# EAGLE design Renard48-6 V4 (EAGLE 5.09)
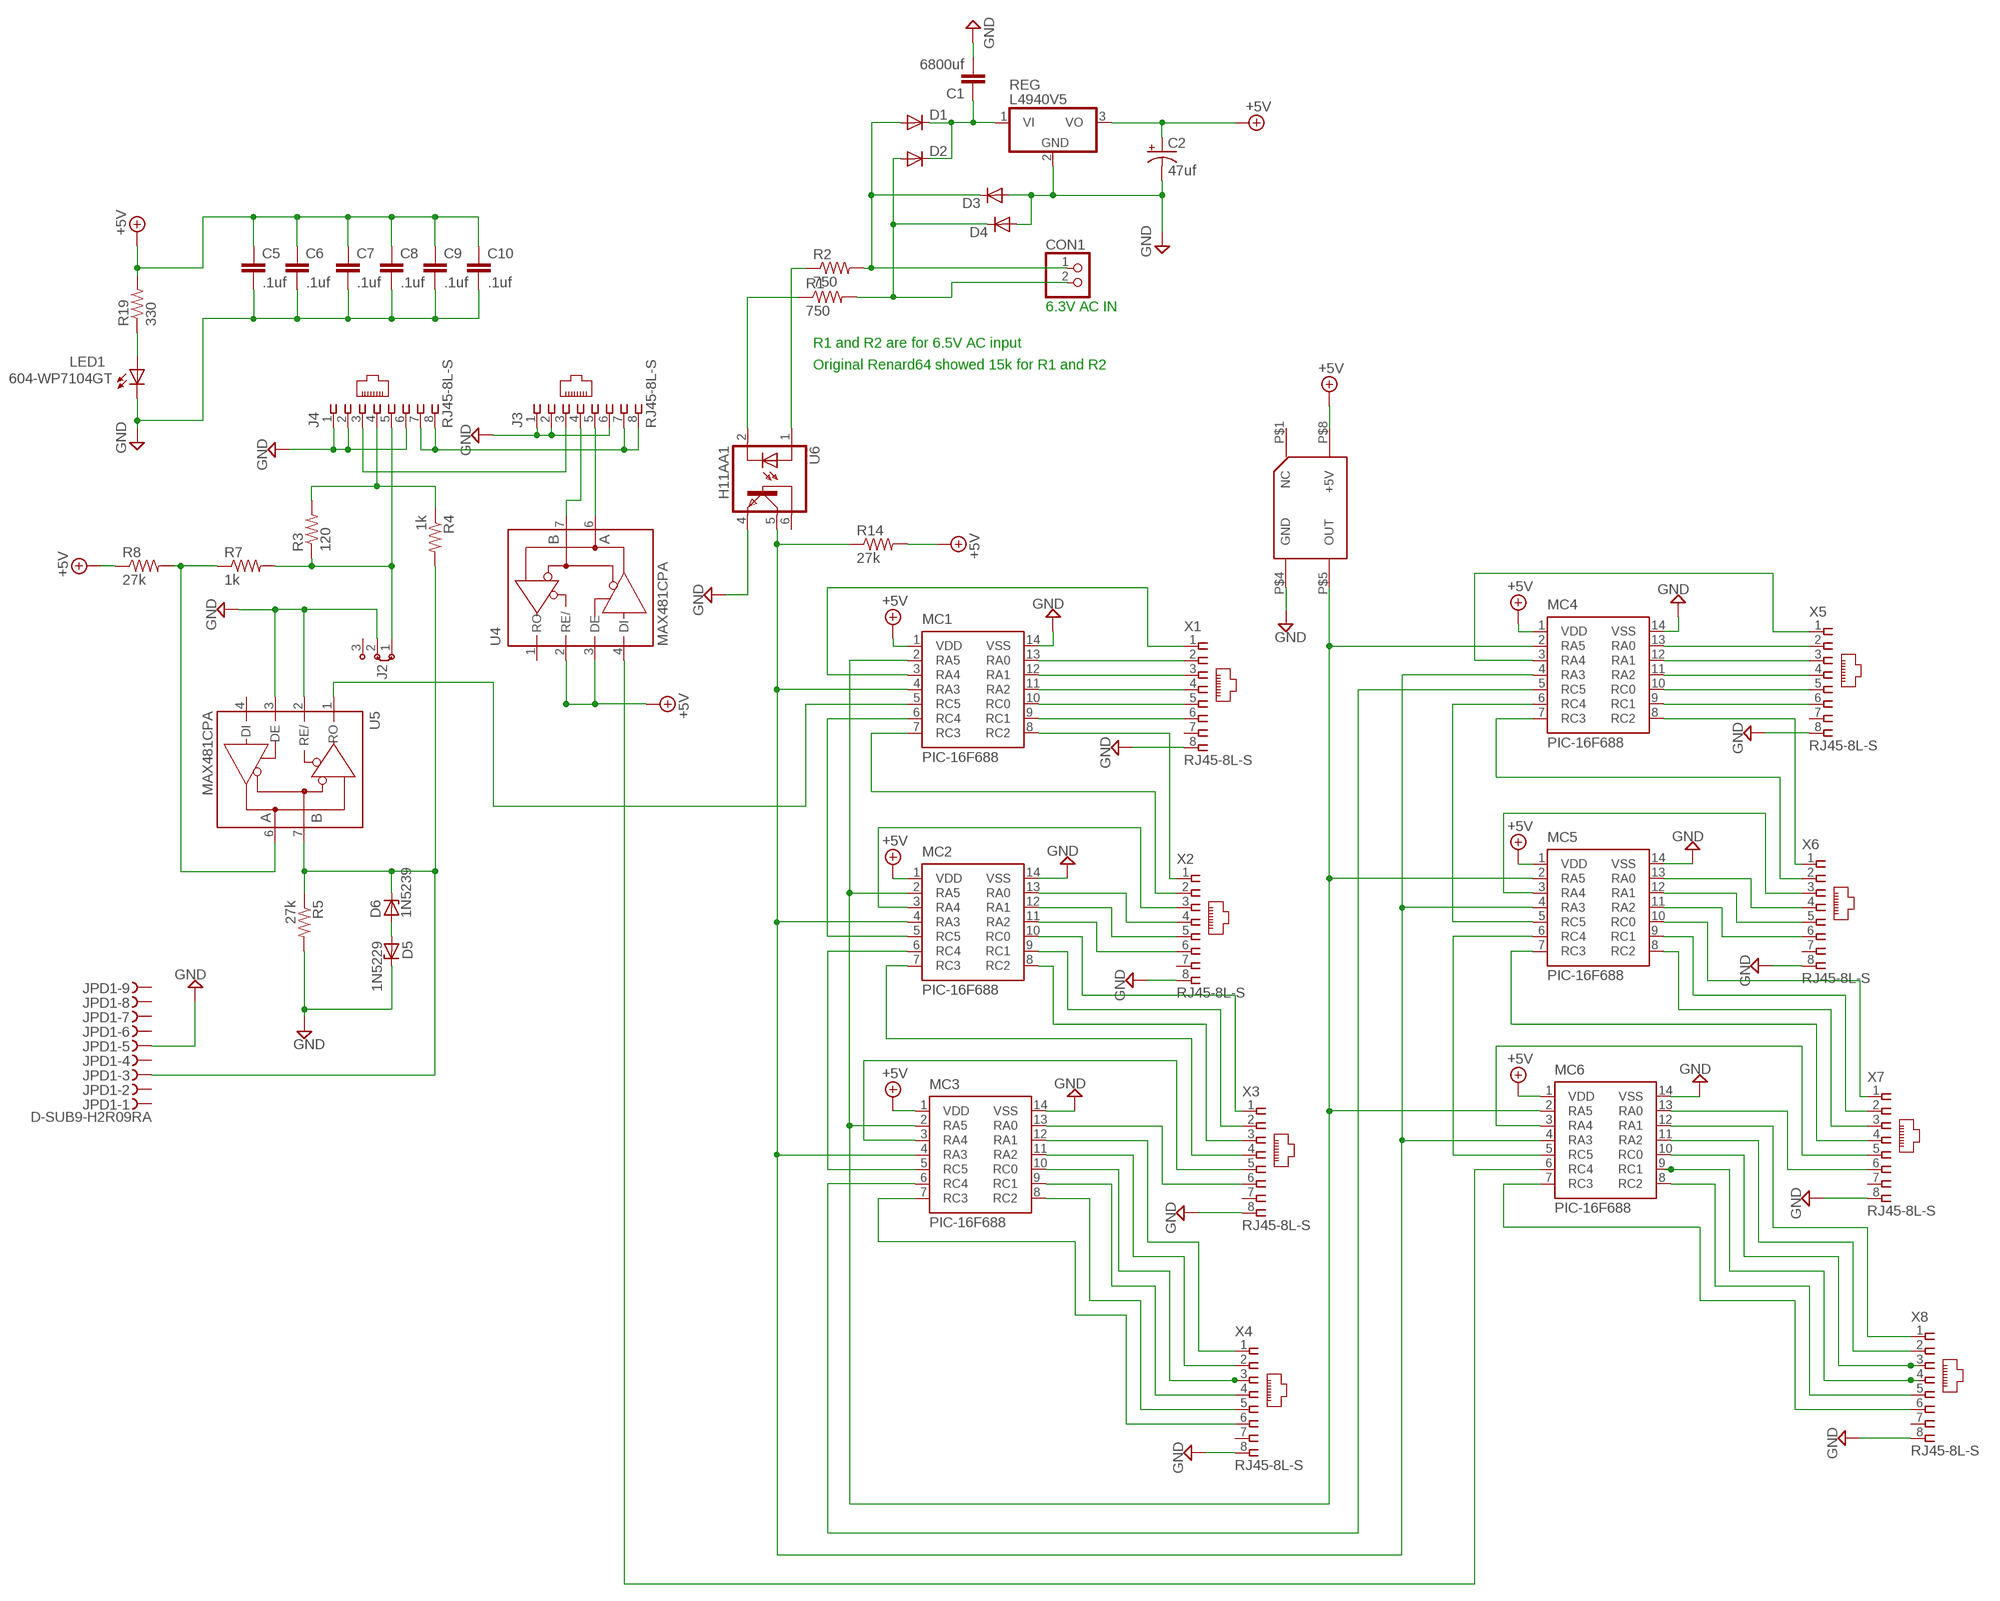
[diagram p0: schematic, sheet 1]

## Parts
C1  6800uf  C7.5/6  [C7.5B6]
C2  47uf  CPOL-USE3.5-8  [E3,5-8]
C5  .1uf  C5/5  [C5B5]
C6  .1uf  C5/5  [C5B5]
C7  .1uf  C5/5  [C5B5]
C8  .1uf  C5/5  [C5B5]
C9  .1uf  C5/5  [C5B5]
C10  .1uf  C5/5  [C5B5]
CON1  PINHD-1X2  [1X02]
D1  DIODE-DO41-10  [DO41-10]
D2  DIODE-DO41-10  [DO41-10]
D3  DIODE-DO41-10  [DO41-10]
D4  DIODE-DO41-10  [DO41-10]
D5  1N5229  ZENER-DIODEDO35Z10  [DO35Z10]
D6  1N5239  ZENER-DIODEDO35Z10  [DO35Z10]
J2  J2X2MM  [04C]
J3  RJ45-8L-S  [RJ45-NO-SHIELD]
J4  RJ45-8L-S  [RJ45-NO-SHIELD]
JPD1  D-SUB9-H2R09RA  [H2R09RA]
LED1  604-WP7104GT  LED3MM  [LED3MM]
MC1  PIC-16F688  [DIL14]
MC2  PIC-16F688  [DIL14]
MC3  PIC-16F688  [DIL14]
MC4  PIC-16F688  [DIL14]
MC5  PIC-16F688  [DIL14]
MC6  PIC-16F688  [DIL14]
OSC  520-TCH1843-X  [4-PIN]
R1  750  R-US_0309/10  [0309/10]
R2  750  R-US_0309/10  [0309/10]
R3  120  R-US_0309/10  [0309/10]
R4  1k  R-US_0309/10  [0309/10]
R5  27k  R-US_0309/10  [0309/10]
R7  1k  R-US_0309/10  [0309/10]
R8  27k  R-US_0309/10  [0309/10]
R14  27k  R-US_0309/10  [0309/10]
R19  330  R-US_0309/10  [0309/10]
REG  L4940V5  7805T  [TO220H]
U4  MAX481CPA  [DIL08]
U5  MAX481CPA  [DIL08]
U6  H11AA1  H11A1M  [DIL06]
X1  RJ45-8L-S  [RJ45-NO-SHIELD]
X2  RJ45-8L-S  [RJ45-NO-SHIELD]
X3  RJ45-8L-S  [RJ45-NO-SHIELD]
X4  RJ45-8L-S  [RJ45-NO-SHIELD]
X5  RJ45-8L-S  [RJ45-NO-SHIELD]
X6  RJ45-8L-S  [RJ45-NO-SHIELD]
X7  RJ45-8L-S  [RJ45-NO-SHIELD]
X8  RJ45-8L-S  [RJ45-NO-SHIELD]

## Nets
+5V: C2.+ C5.1 C6.1 C7.1 C8.1 C9.1 C10.1 MC1.1(VDD) MC2.1(VDD) MC3.1(VDD) MC4.1(VDD) MC5.1(VDD) MC6.1(VDD) OSC.P$8(+5V) R8.1 R14.2 R19.2 REG.3(VO) U4.2(RE/) U4.3(DE)
GND: C1.2 C2.- C5.2 C6.2 C7.2 C8.2 C9.2 C10.2 D3.A D4.A D5.C J2.2 J3.1 J3.2 J3.6 J4.1 J4.2 J4.6 JPD1.5 LED1.K(C) MC1.14(VSS) MC2.14(VSS) MC3.14(VSS) MC4.14(VSS) MC5.14(VSS) MC6.14(VSS) OSC.P$4(GND) R5.2 REG.2(GND) U5.2(RE/) U5.3(DE) U6.4(EMI) X1.8 X2.8 X3.8 X4.8 X5.8 X6.8 X7.8 X8.8
N$1: MC1.3(RA4) X1.1
N$2: MC1.13(RA0) X1.2
N$3: MC1.12(RA1) X1.3
N$4: MC1.11(RA2) X1.4
N$5: MC1.10(RC0) X1.5
N$6: MC1.9(RC1) X1.6
N$7: J2.1 J4.5 R3.1 R7.2
N$8: J3.7 J3.8 J4.7 J4.8
N$9: MC1.8(RC2) X2.1
N$10: MC2.13(RA0) X2.4
N$11: MC2.3(RA4) X2.3
N$12: MC2.12(RA1) X2.5
N$13: MC2.11(RA2) X2.6
N$14: MC2.10(RC0) X3.1
N$15: MC2.9(RC1) X3.2
N$16: MC1.7(RC3) X2.2
N$17: MC2.8(RC2) X3.3
N$18: MC3.3(RA4) X3.5
N$19: MC6.6(RC4) U4.4(DI)
N$20: CON1.1 D1.A D3.C R2.2
N$21: MC3.13(RA0) X3.6
N$22: MC3.12(RA1) X4.1
N$23: MC3.11(RA2) X4.2
N$24: MC2.7(RC3) X3.4
N$25: MC3.10(RC0) X4.3
N$26: J3.5 U4.6(A)
N$27: MC6.3(RA4) X7.5
N$28: MC3.7(RC3) X4.6
N$29: J3.4 U4.7(B)
N$30: J3.3 J4.3
N$31: R7.1 R8.2 U5.6(A)
N$32: J4.4 R3.2 R4.1
N$33: D6.C JPD1.3 R4.2 R5.1 U5.7(B)
N$34: D5.A D6.A
N$35: CON1.2 D2.A D4.C R1.2
N$36: R2.1 U6.1(A)
N$37: R1.1 U6.2(C)
N$38: MC1.5(RC5) U5.1(RO)
N$39: MC3.8(RC2) X4.5
N$40: MC4.3(RA4) X5.1
N$41: MC5.3(RA4) X6.3
N$42: MC3.9(RC1) X4.4
N$43: MC5.7(RC3) X7.4
N$44: MC6.7(RC3) X8.6
N$45: MC4.7(RC3) X6.2
N$46: LED1.A R19.1
N$47: MC3.6(RC4) MC4.5(RC5)
N$48: MC5.6(RC4) MC6.5(RC5)
N$49: MC4.6(RC4) MC5.5(RC5)
N$50: MC4.13(RA0) X5.2
N$51: MC4.12(RA1) X5.3
N$52: MC4.11(RA2) X5.4
N$53: MC4.10(RC0) X5.5
N$54: MC4.9(RC1) X5.6
N$55: MC4.8(RC2) X6.1
N$56: MC5.13(RA0) X6.4
N$57: MC5.12(RA1) X6.5
N$58: MC5.11(RA2) X6.6
N$59: MC5.10(RC0) X7.1
N$60: MC5.9(RC1) X7.2
N$61: MC5.8(RC2) X7.3
N$62: MC1.2(RA5) MC2.2(RA5) MC3.2(RA5) MC4.2(RA5) MC5.2(RA5) MC6.2(RA5) OSC.P$5(OUT)
N$63: MC6.13(RA0) X7.6
N$64: MC6.12(RA1) X8.1
N$65: MC6.11(RA2) X8.2
N$66: MC6.10(RC0) X8.3
N$67: MC6.9(RC1) X8.4
N$68: MC6.8(RC2) X8.5
N$70: C1.1 D1.C D2.C REG.1(VI)
N$80: MC1.4(RA3) MC2.4(RA3) MC3.4(RA3) MC4.4(RA3) MC5.4(RA3) MC6.4(RA3) R14.1 U6.5(COL)
N$81: MC1.6(RC4) MC2.5(RC5)
N$82: MC2.6(RC4) MC3.5(RC5)
Unconnected: J2.3 JPD1.1 JPD1.2 JPD1.4 JPD1.6 JPD1.7 JPD1.8 JPD1.9 OSC.P$1(NC) U4.1(RO) U5.4(DI) U6.6(BAS) X1.7 X2.7 X3.7 X4.7 X5.7 X6.7 X7.7 X8.7

## Notes on the sheet
- 6.3V AC IN
- R1 and R2 are for 6.5V AC input
- Original Renard64 showed 15k for R1 and R2

## Power pins joined to a net without a drawn wire
GND: U4.5(GND) U5.5(GND)
VCC: U4.8(VCC) U5.8(VCC)

## Library data of the parts
C1 C5-C10 = capacitor-wima:C: CAPACITOR naming: grid - package width
C2 = rcl:CPOL-US: POLARIZED CAPACITOR, American symbol
CON1 = pinhead:PINHD-1X2: PIN HEADER
D1-D4 = diode:DIODE-: DIODE
D5 D6 = diode:ZENER-DIODE: Z-Diode
J2 = jumper:J2: Jumper switch 2 x 2.5 mm
J3 J4 X1-X8 = con-tycoelectronics:RJ45: CORCOM Modular RJ Jacks No Shield Source: www.tycoelectronics.com .. ENG_DS_1654001_1099_RJ_L_0507.pdf
JPD1 = con-thomas-betts:D-SUB9-: D-Subminiatur Connector Source: Electronioc Interconnects European Edition 1998
LED1 = led:LED: LED OSRAM: - CHIPLED LG R971, LG N971, LY N971, LG Q971, LY Q971, LO R971, LY R971 LH N974, LH R974 LS Q976, LO Q976, LY Q976 LO Q996 - Hyper CHIPLED LW Q18S LB Q993, LB Q99A, LB R99A - SideLED LS A670, LO A670, LY A670, LG A670, LP A670 LB A673, LV A673, LT A673, LW A673 LH A674 LY A675 LS A676, LA A676, LO A676, LY A676, LW A676 LS A679, LY A679, LG A679 - Hyper Micro SIDELED® LS Y876, LA Y876, LO Y876, LY Y876 LT Y87S - SmartLED LW L88C, LW L88S LB L89C, LB L89S, LG L890 LS L89K, LO L89K, LY L89K LS L896, LA L896, LO L896, LY L896 - TOPLED LS T670, LO T670, LY T670, LG T670, LP T670 LSG T670, LSP T670, LSY T670, LOP T670, LYG T670 LG T671, LOG T671, LSG T671 LB T673, LV T673, LT T673, LW T673 LH T674 LS T676, LA T676, LO T676, LY T676, LB T676, LH T676, LSB T676, LW T676 LB T67C, LV T67C, LT T67C, LS T67K, LO T67K, LY T67K, LW E67C LS E67B, LA E67B, LO E67B, LY E67B, LB E67C, LV E67C, LT E67C LW T67C LS T679, LY T679, LG T679 LS T770, LO T770, LY T770, LG T770, LP T770 LB T773, LV T773, LT T773, LW T773 LH T774 LS E675, LA E675, LY E675, LS T675 LS T776, LA T776, LO T776, LY T776, LB T776 LHGB T686 LT T68C, LB T68C - Hyper Mini TOPLED® LB M676 - Mini TOPLED Santana® LG M470 LS M47K, LO M47K, LY M47K Source: http://www.osram.convergy.de LUXEON: - LUMILED® LXK2-PW12-R00, LXK2-PW12-S00, LXK2-PW14-U00, LXK2-PW14-V00 LXK2-PM12-R00, LXK2-PM12-S00, LXK2-PM14-U00 LXK2-PE12-Q00, LXK2-PE12-R00, LXK2-PE12-S00, LXK2-PE14-T00, LXK2-PE14-U00 LXK2-PB12-K00, LXK2-PB12-L00, LXK2-PB12-M00, LXK2-PB14-N00, LXK2-PB14-P00, LXK2-PB14-Q00 LXK2-PR12-L00, LXK2-PR12-M00, LXK2-PR14-Q00, LXK2-PR14-R00 LXK2-PD12-Q00, LXK2-PD12-R00, LXK2-PD12-S00 LXK2-PH12-R00, LXK2-PH12-S00 LXK2-PL12-P00, LXK2-PL12-Q00, LXK2-PL12-R00 Source: www.luxeon.com KINGBRIGHT: KA-3528ASYC Source: www.kingbright.com
MC1-MC6 = microchip:PIC-16F688: 14 Pin Dip Pic controller
OSC = Oscillators:520-TCH1843-X: XO Oscillators DIP-8 5V 18.432MHz
R1-R5 R7 R8 R14 R19 = resistor:R-US_: RESISTOR, American symbol
REG = linear:78*: Positive VOLTAGE REGULATOR Source: http://cache.national.com/ds/LM/LM78L05.pdf http://www.fairchildsemi.com/ds/LM/LM7805.pdf
U4 U5 = maxim:MAX481CPA: RS485 TRANSEIVER
U6 = optocoupler:H11A*?M: General Purpose 6-Pin Phototransistor Optocouplers Source: http://www.fairchildsemi.com/ds/4N/4N35-M.pdf

## Board
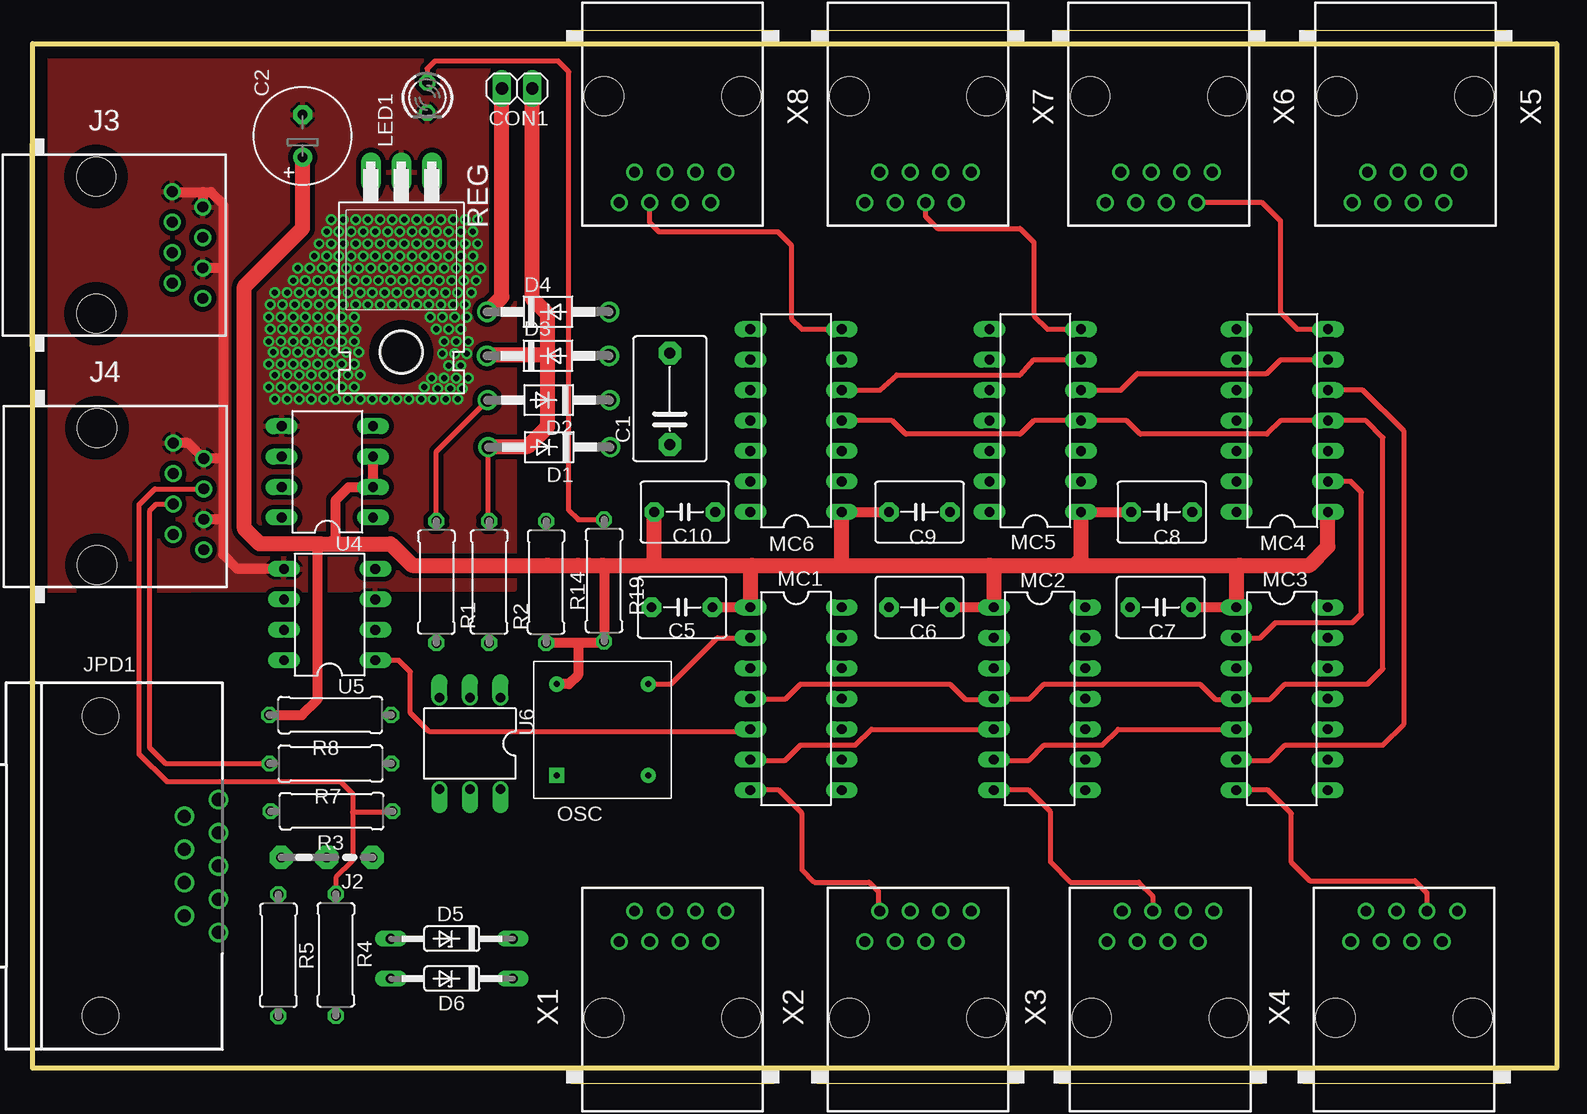
[diagram p1: board, top side]
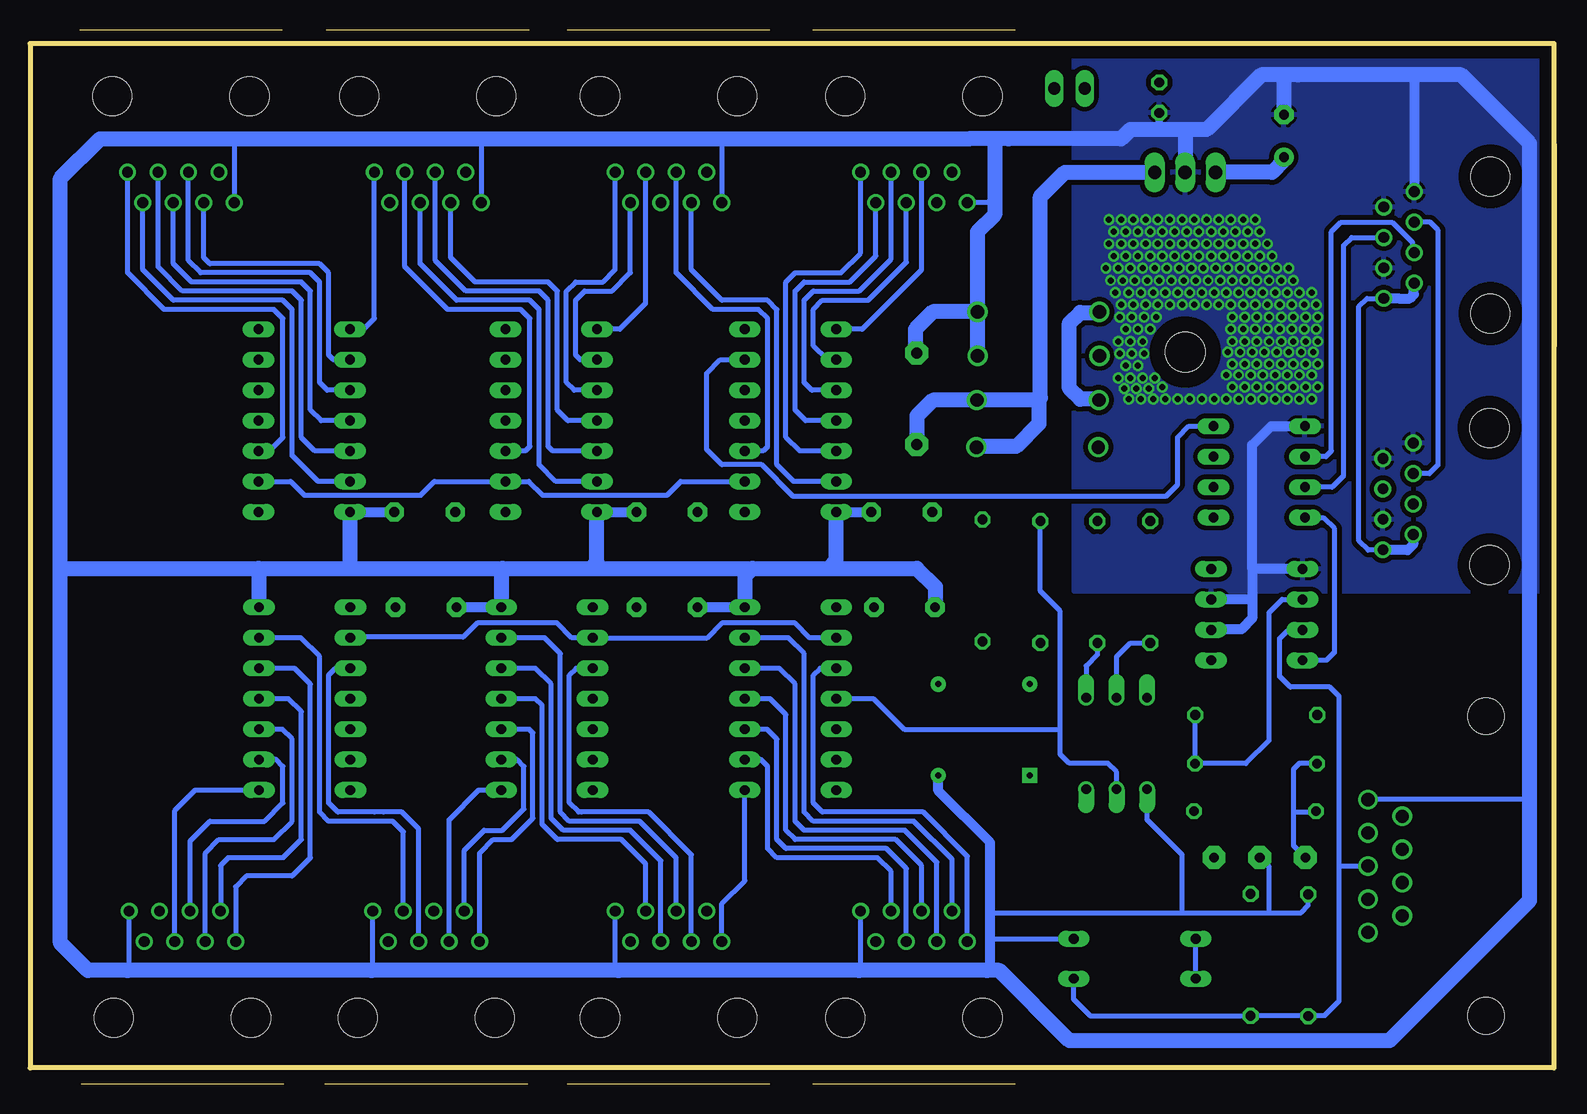
[diagram p2: board, bottom side, seen from below]

Size 127 x 85.4 mm. Coordinates in mm from the lower left corner, seen from the top.
Outline: 127,0 127,85.4 0,85.4 0,0 127,0
Outline: 127,0 126.97,-0.02
Copper layers (1*16): Top 0.035mm / dielectric 1.5mm / Bottom 0.035mm
Design rules "default": minimum track width 10mil, minimum drill 24mil, track to track 8mil, track to pad 8mil, pad to pad 8mil, via to via 8mil, smd to smd 8mil, copper to edge 40mil, drill to drill 8mil, minimum pad ring 10mil, minimum via ring 8mil, stop-mask expansion 4mil, vias tented up to drill 0mil, thermal gap 10mil

### Footprints (pad centres in the part's own frame; a part is rotated, then mirrored left to right if it is on the bottom)
C7.5B6 = drill 0.914 pad 1.905 octagon: 1 -3.81,0; 2 3.81,0
E3,5-8 = drill 0.813 pad 1.6 round: + -1.778,0 | drill 0.813 pad 1.6 octagon: - 1.778,0
C5B5 = drill 0.813 pad 1.6 octagon: 1 -2.54,0; 2 2.54,0
1X02 = drill 1.016 long: 1 -1.27,0; 2 1.27,0
DO41-10 = drill 1.118 round: A 5.08,0; C -5.08,0
DO35Z10 = drill 0.813 long: A 5.08,0; C -5.08,0
04C = drill 0.813 pad 1.905 octagon: 1 -1.905,0; 2 1.905,0; 3 5.715,0
RJ45-NO-SHIELD = drill 0.9 pad 1.4 round: 1 -4.445,6.35; 2 -3.175,8.89; 3 -1.905,6.35; 4 -0.635,8.89; 5 0.635,6.35; 6 1.905,8.89; 7 3.175,6.35; 8 4.445,8.89 | hole 3.251: -5.715,0; 5.715,0
H2R09RA = drill 1.092 round: 1 5.537,7.925; 2 2.769,7.925; 3 0,7.925; 4 -2.769,7.925; 5 -5.537,7.925; 6 4.153,5.08; 7 1.384,5.08; 8 -1.384,5.08; 9 -4.153,5.08 | hole 3.048: -12.497,-1.905; 12.497,-1.905
LED3MM = drill 0.813 octagon: A -1.27,0; K 1.27,0
DIL14 = drill 0.813 long: 1 -7.62,-3.81; 2 -5.08,-3.81; 3 -2.54,-3.81; 4 0,-3.81; 5 2.54,-3.81; 6 5.08,-3.81; 7 7.62,-3.81; 8 7.62,3.81; 9 5.08,3.81; 10 2.54,3.81; 11 0,3.81; 12 -2.54,3.81; 13 -5.08,3.81; 14 -7.62,3.81
4-PIN = drill 0.5 pad 1.27 square: P$1 0,-7.62 | drill 0.5 pad 1.27 round: P$4 7.62,-7.62; P$5 7.62,0; P$8 0,0
0309/10 = drill 0.813 octagon: 1 -5.08,0; 2 5.08,0
TO220H = drill 1.118 long: 1 -2.54,-10.16; 2 0,-10.16; 3 2.54,-10.16 | hole 3.302: 0,4.826
DIL08 = drill 0.813 long: 1 -3.81,-3.81; 2 -1.27,-3.81; 3 1.27,-3.81; 4 3.81,-3.81; 5 3.81,3.81; 6 1.27,3.81; 7 -1.27,3.81; 8 -3.81,3.81
DIL06 = drill 0.813 offset: 1 -2.54,-3.81; 2 0,-3.81; 3 2.54,-3.81; 4 2.54,3.81; 5 0,3.81; 6 -2.54,3.81

### Placement (x,y rotation side)
C1  53.12,55.8 90 top
C2  22.51,77.7 90 top
C5  54.13,38.4 180 top
C6  73.91,38.4 180 top
C7  94.01,38.4 180 top
C8  94.11,46.35 0 top
C9  73.91,46.35 0 top
C10  54.36,46.35 0 top
CON1  40.39,81.66 180 top
D1  43.06,51.76 180 top
D2  43.01,55.68 180 top
D3  42.95,59.38 0 top
D4  42.96,63.04 0 top
D5  34.94,10.78 180 top
D6  34.94,7.45 180 top
J2  22.62,17.54 0 top
J3  5.3,68.61 270 top
J4  5.37,47.65 270 top
JPD1  7.57,16.84 270 top
LED1  32.89,80.9 270 top
MC1  63.63,30.78 270 top
MC2  83.92,30.78 270 top
MC3  104.11,30.78 270 top
MC4  104.14,53.98 90 top
MC5  83.57,53.98 90 top
MC6  63.63,53.98 90 top
OSC  43.69,32 0 top
R1  33.66,40.51 90 top
R2  38.05,40.51 90 top
R3  24.92,21.41 0 top
R4  25.28,9.43 270 top
R5  20.49,9.4 90 top
R7  24.83,25.37 180 top
R8  24.81,29.43 0 top
R14  42.8,40.51 270 top
R19  47.62,40.64 270 top
REG  30.73,64.52 180 top
U4  24.57,49.7 90 top
U5  24.76,37.8 90 top
U6  36.45,27.05 180 top
X1  53.34,4.19 0 top
X2  73.79,4.19 0 top
X3  93.98,4.19 0 top
X4  114.3,4.19 0 top
X5  114.43,81.03 180 top
X6  93.85,81.03 180 top
X7  73.79,81.03 180 top
X8  53.34,81.03 180 top

### Tracks (layer width: path | path; a pad name or v marks a point on that pad's centre or on a via)
+5V
  Top 0.406: 42.93,41.91 42.8,41.78 | 46.35,41.91 46.23,41.78
  Top 0.813: MC1.1 C5.1 | MC6.1 C9.1 | MC2.1 C6.1 | MC5.1 C8.1 | MC3.1 C7.1 | 28.33,50.93 U4.3 U4.2 26.33,48.43 25.27,47.37 25.27,44.07 24.89,43.69 | R8.1 22.44,29.43 23.75,30.73 23.75,43.43 24,43.69 | 45.47,41.91 45.34,41.78 | 47.5,41.91 47.62,41.78 R19.2 47.5,35.43 45.47,35.43 | 45.47,35.43 R14.2 | OSC.P$8 44.7,32 45.47,32.77 45.47,35.43
  Top 1.27: 59.94,41.91 67.56,41.91 | 67.56,41.91 79.76,41.91 | 79.76,41.91 86.87,41.91 | 86.87,41.91 100.58,41.91 | 100.58,41.91 106.43,41.91 107.95,43.43 MC4.1 | MC3.1 100.31,41.63 100.58,41.91 | MC5.1 87.38,42.42 86.87,41.91 | MC2.1 80.11,41.55 79.76,41.91 | MC6.1 67.44,42.04 67.56,41.91 | MC1.1 59.82,41.78 59.94,41.91 | 51.94,41.91 47.5,41.91 46.35,41.91 45.47,41.91 42.93,41.91 31.62,41.91 29.84,43.69 24.89,43.69 24,43.69 18.92,43.69 17.65,44.96 17.65,65.15 22.51,70 C2.+ | 51.94,41.91 59.94,41.91 | C10.1 51.82,42.04 51.94,41.91 | REG.3 28.19,73.28
  Bottom 1.27: C2.+ 22.51,75.66 23.5,74.68 REG.3
GND  (via drill 0.5)
  Top 0.813: J4.1 12.99,52.09 J4.2 15.77,50.82 15.88,50.93 | 15.88,45.59 15.88,42.8 17.02,41.66 20.9,41.66 U5.5 | J4.6 15.73,45.74 15.88,45.59 | 15.88,50.93 15.88,45.59 | 15.88,66.8 15.88,50.93 | J3.6 15.77,66.7 15.88,66.8 | 15.88,66.8 15.88,72.01 14.86,73.03 14.22,73.03 | 14.22,73.03 11.68,73.03 J3.1 | J3.2 14.19,72.99 14.22,73.03
  Bottom 0.406: 48.77,77.47 48.9,77.85 | X7.8 69.34,77.72 68.07,77.47 | X6.8 89.41,77.72 89.15,77.47 | X5.8 109.98,77.72 109.73,77.47 | X4.8 118.75,8.26 118.87,8.13 | X3.8 98.42,8.26 98.55,8.13 | X2.8 78.23,8.38 77.98,8.13 | X1.8 57.78,8.26 57.91,8.13 | 11.68,82.8 11.65,82.77 11.65,82.58 11.43,82.8 | 2.03,22.61 2.56,22.37 JPD1.5 15.5,22.35 | 46.99,12.95 30.99,12.95 | U6.4 33.91,20.7 30.99,17.78 30.99,12.95 | D5.C 46.88,10.78 46.99,10.67 | 30.99,12.95 23.75,12.95 | 23.75,12.95 21.08,12.95 20.49,13.55 R5.2 | J2.2 23.75,16.77 23.75,12.95 | X8.8 46.74,72.14 46.61,72.26
  Bottom 0.61: LED1.K 32.89,78.36 32.77,78.23
  Bottom 0.813: MC6.14 C10.2 | MC5.14 C9.2 | MC4.14 C8.2 | MC2.14 C7.2 | MC1.14 C6.2 | 47.24,8.13 46.99,8.13 46.99,10.67 46.99,12.95 46.99,18.8 51.31,23.11 OSC.P$4 | 45.47,77.47 45.5,77.44 | 21.34,82.8 21.36,82.78 | 11.65,82.58 J3.1 | U4.5 23.58,53.51 25.15,51.94 25.15,41.66 | 25.15,38.99 25.15,37.47 26.04,36.58 28.52,36.58 U5.2 | 25.15,41.66 25.15,38.99 | U5.3 25.22,39.07 25.15,38.99 | U5.5 25.1,41.61 25.15,41.66
  Bottom 1.27: 124.46,41.66 124.46,10.41 122.17,8.13 118.87,8.13 98.55,8.13 77.98,8.13 57.91,8.13 47.24,8.13 46.23,8.13 40.39,2.29 13.72,2.29 2.03,13.97 2.03,22.61 2.03,77.09 7.75,82.8 11.43,82.8 21.34,82.8 22.73,82.8 | 124.46,41.66 124.46,74.17 121.16,77.47 109.73,77.47 89.15,77.47 68.07,77.47 48.77,77.47 46.48,77.47 | 66.8,41.66 60.45,41.66 | 80.26,41.66 66.8,41.66 | 87.63,41.66 80.26,41.66 | 100.58,41.66 87.63,41.66 | 107.95,38.43 MC3.14 107.92,41.63 107.95,41.66 | MC4.14 100.33,41.91 100.58,41.66 | MC2.14 87.73,41.55 87.63,41.66 | MC5.14 79.76,42.16 80.26,41.66 | MC1.14 67.44,41.02 66.8,41.66 | MC6.14 59.82,42.29 60.45,41.66 | 124.46,41.66 107.95,41.66 | 107.95,41.66 100.58,41.66 | 46.48,77.47 45.47,77.47 36.07,77.47 35.31,78.23 32.77,78.23 30.99,78.23 | 60.45,41.66 53.09,41.66 51.56,40.13 51.56,38.43 C5.2 | C2.- 22.51,82.58 22.73,82.8 | D4.A 51.77,63.04 53.21,61.59 53.21,59.7 C1.2 | D4.A 48.04,69.69 46.61,71.12 46.61,72.26 46.61,77.34 46.48,77.47 | D4.A 48.04,59.38 D3.A | 30.99,78.23 28.96,78.23 24.38,82.8 22.73,82.8 | REG.2 30.73,77.98 30.99,78.23
  other vias: 26.92,70.74 27.94,70.74 28.96,70.74 29.97,70.74 30.99,70.74 32,70.74 33.02,70.74 34.04,70.74 35.05,70.74 25.91,70.74 24.89,70.74 36.07,70.74 37.08,70.74 25.53,67.69 26.54,67.69 27.56,67.69 28.57,67.69 29.59,67.69 30.61,67.69 31.62,67.69 32.64,67.69 33.66,67.69 24.51,67.69 23.5,67.69 34.67,67.69 35.69,67.69 36.7,67.69 25.91,68.71 26.92,68.71 27.94,68.71 28.96,68.71 29.97,68.71 30.99,68.71 32,68.71 33.02,68.71 34.04,68.71 24.89,68.71 23.88,68.71 35.05,68.71 36.07,68.71 37.08,68.71 26.54,69.72 27.56,69.72 28.57,69.72 29.59,69.72 30.61,69.72 31.62,69.72 32.64,69.72 33.66,69.72 34.67,69.72 25.53,69.72 24.51,69.72 35.69,69.72 36.7,69.72 24.13,66.67 25.15,66.67 26.16,66.67 27.18,66.67 28.19,66.67 29.21,66.67 30.23,66.67 31.24,66.67 32.26,66.67 23.11,66.67 22.1,66.67 33.27,66.67 34.29,66.67 35.31,66.67 36.32,66.67 37.34,66.67 23.75,65.66 24.77,65.66 25.78,65.66 26.8,65.66 27.81,65.66 28.83,65.66 29.84,65.66 30.86,65.66 31.88,65.66 22.73,65.66 21.72,65.66 32.89,65.66 33.91,65.66 34.92,65.66 35.94,65.66 36.96,65.66 22.23,64.64 23.24,64.64 24.26,64.64 25.27,64.64 26.29,64.64 27.3,64.64 28.32,64.64 29.34,64.64 30.35,64.64 21.21,64.64 20.19,64.64 31.37,64.64 32.38,64.64 33.4,64.64 34.42,64.64 35.43,64.64 36.58,64.64 21.84,63.63 22.86,63.63 23.88,63.63 24.89,63.63 25.91,63.63 26.92,63.63 27.94,63.63 28.96,63.63 29.97,63.63 20.83,63.63 19.81,63.63 30.99,63.63 32,63.63 33.02,63.63 34.04,63.63 35.05,63.63 36.07,63.63 21.72,62.61 22.73,62.61 23.75,62.61 24.77,62.61 25.78,62.61 26.8,62.61 20.7,62.61 19.68,62.61 21.84,61.59 22.86,61.59 23.88,61.59 24.89,61.59 25.91,61.59 26.92,61.59 20.83,61.59 19.81,61.59 21.72,60.58 22.73,60.58 23.75,60.58 24.77,60.58 25.78,60.58 26.8,60.58 20.7,60.58 19.68,60.58 22.1,59.69 23.11,59.69 24.13,59.69 25.15,59.69 26.16,59.69 27.18,59.69 21.08,59.69 20.07,59.69 21.72,58.67 22.73,58.67 23.75,58.67 24.77,58.67 25.78,58.67 26.8,58.67 20.7,58.67 19.68,58.67 22.23,57.78 23.24,57.78 24.26,57.78 25.27,57.78 26.29,57.78 27.3,57.78 21.21,57.78 20.19,57.78 21.72,56.77 22.73,56.77 23.75,56.77 24.77,56.77 25.78,56.77 26.8,56.77 20.7,56.77 19.68,56.77 22.23,55.75 23.24,55.75 24.26,55.75 25.27,55.75 26.29,55.75 27.3,55.75 21.21,55.75 20.19,55.75 33.15,62.61 34.16,62.61 35.18,62.61 36.2,62.61 33.66,61.59 34.67,61.59 35.69,61.59 34.29,60.58 35.31,60.58 36.32,60.58 34.16,59.56 35.18,59.56 36.2,59.56 34.67,58.55 35.69,58.55 33.27,57.53 34.29,57.53 35.31,57.53 36.32,57.53 30.35,55.75 31.37,55.75 32.38,55.75 33.4,55.75 34.42,55.75 35.43,55.75 29.34,55.75 28.32,55.75 32.64,56.77 33.78,56.64 34.8,56.64 35.81,56.64
  pour Top (isolate 0.406): -0.25,85.34 40.13,85.47 40.13,39.88 -0.25,39.75
  pour Bottom (isolate 0.406): 0,85.34 40.01,85.34 40.01,39.75 0,39.75
N$1
  Bottom 0.406: MC1.3 61.16,33.33 61.72,32.77 61.72,22.1 60.96,21.34 52.58,21.34 48.9,17.65 X1.1
N$2
  Bottom 0.406: MC1.13 63.8,35.87 62.48,34.54 62.48,21.34 61.72,20.57 53.34,20.57 50.16,17.4 X1.2
N$3
  Bottom 0.406: MC1.12 64.57,33.33 63.25,32 63.25,20.57 62.48,19.81 54.1,19.81 51.44,17.14 X1.3
N$4
  Bottom 0.406: MC1.11 65.33,30.79 64.01,29.46 64.01,19.81 63.25,19.05 54.86,19.05 52.7,16.89 X1.4
N$5
  Bottom 0.406: MC1.10 65.58,28.25 64.77,27.43 64.77,19.05 64.01,18.29 55.63,18.29 53.98,16.64 X1.5
N$6
  Bottom 0.406: MC1.9 66.09,25.7 65.53,25.15 65.53,18.29 64.77,17.53 56.39,17.53 55.24,16.38 X1.6
N$7
  Top 0.406: J4.5 10.31,47.01 9.78,46.48 9.78,26.67 11.05,25.4 19.75,25.4 R7.2
  Bottom 0.406: 21.72,21.34 21.72,18.54 J2.1 | R3.1 19.91,21.34 21.72,21.34 | 21.72,21.34 21.72,24.89 21.21,25.4 19.75,25.4 R7.2
N$8
  Bottom 0.406: J4.7 11.74,44.45 | 12.95,64.16 15.6,64.16 16.26,63.5 16.26,43.94 15.49,43.18 14.28,43.18 J4.8
  Bottom 0.813: 11.74,44.45 11.74,43.63 12.19,43.18 14.24,43.18 J4.8 | J3.8 12.95,64.16 12.04,64.16 11.68,64.52 11.68,65.4 J3.7
N$9
  Bottom 0.406: MC1.8 67.44,15.62 69.34,13.72 X2.1
N$10
  Bottom 0.406: X2.4 73.15,17.53 76.2,20.57 82.04,20.57 82.8,21.34 82.8,34.54 84.12,35.87 MC2.13
N$11
  Bottom 0.406: X2.3 71.88,17.78 75.44,21.34 81.03,21.34 81.28,21.34 82.04,22.1 82.04,32.77 81.48,33.33 MC2.3
N$12
  Bottom 0.406: X2.5 74.42,17.27 76.96,19.81 82.55,19.81 83.57,20.83 83.57,32 84.89,33.33 MC2.12
N$13
  Bottom 0.406: X2.6 75.69,17.02 77.72,19.05 83.06,19.05 84.33,20.32 84.33,30.23 84.89,30.79 MC2.11
N$14
  Bottom 0.406: X3.1 89.53,17.91 88.39,19.05 86.87,19.05 85.09,20.83 85.09,27.94 85.39,28.25 MC2.10
N$15
  Bottom 0.406: X3.2 90.81,18.16 89.15,19.81 87.63,19.81 85.85,21.59 85.85,25.15 86.41,25.7 MC2.9
N$16
  Top 0.406: MC1.7 62.18,23.16 64.14,21.21 64.14,16.51 65.15,15.49 69.72,15.49 70.48,14.73 70.48,13.21 X2.2
N$17
  Bottom 0.406: MC2.8 89.61,23.16 92.08,20.7 X3.3
N$18
  Bottom 0.406: MC3.3 101.55,33.33 102.11,32.77 102.11,22.1 101.35,21.34 98.3,21.34 97.54,21.34 96.01,21.34 94.61,19.94 X3.5
N$19
  Bottom 0.406: MC6.6 69.47,59.05 70.61,57.91 70.61,51.56 69.34,50.29 66.04,50.29 63.4,47.65 32.36,47.65 31.37,48.64 31.37,52.58 30.43,53.51 U4.4 28.4,53.49
N$20
  Top 0.406: D1.A 37.98,45.66 R2.2
  Top 1.27: 42.93,59.44 42.93,53.47 41.27,51.82 38.04,51.82 D1.A | 42.93,59.44 37.94,59.44 D3.C | CON1.1 41.66,64.14 42.93,62.87 42.93,59.44 | 42.93,59.44 42.99,59.37
N$21
  Bottom 0.406: MC3.13 104.44,35.87 102.87,34.29 102.87,21.34 102.11,20.57 96.77,20.57 95.89,19.68 X3.6
N$22
  Bottom 0.406: MC3.12 104.95,33.33 103.63,32 103.63,17.53 105.16,16 108.97,16 109.86,15.11 X4.1
N$23
  Bottom 0.406: MC3.11 105.46,30.79 104.39,29.72 104.39,19.05 105.92,17.53 110.49,17.53 111.12,16.89 X4.2
N$24
  Top 0.406: MC2.7 83.01,23.16 84.84,21.34 84.84,17.14 86.49,15.49 92.2,15.49 93.34,14.35 X3.4
N$25
  Bottom 0.406: MC3.10 105.97,28.25 105.16,27.43 105.16,20.57 106.68,19.05 111.25,19.05 112.39,17.91 X4.3
N$26
  Bottom 0.406: U4.6 19,50.97 18.54,51.44 18.54,69.72 17.75,70.51 13.49,70.51 11.81,68.83 11.81,68.13 J3.5
N$27
  Bottom 0.406: MC6.3 65.91,51.44 65.53,51.82 65.53,62.48 66.29,63.25 70.1,63.25 73.15,66.29 X7.5
N$28
  Top 0.406: MC3.7 102.95,23.16 104.9,21.21 104.9,17.14 106.43,15.62 115.19,15.62 116.2,14.61 X4.6
N$29
  Bottom 0.406: U4.7 18.5,48.43 17.53,49.4 17.53,68.58 16.87,69.24 J3.4
N$30
  Bottom 0.406: J4.3 10.39,49.55 9.65,50.29 9.65,69.85 10.31,70.51 J3.3
N$31
  Bottom 0.406: R8.2 29.91,29.4 R7.1 25.68,25.38 23.75,27.3 23.75,37.97 22.66,39.07 U5.6
N$32
  Top 0.406: R4.1 25.28,15.88 26.67,17.27 26.67,21.34 | 26.67,21.34 26.67,22.86 25.65,23.88 11.18,23.88 8.89,26.16 8.89,46.99 10.19,48.28 J4.4 | R3.2 29.93,21.34 26.67,21.34
N$33
  Bottom 0.406: D6.C 40.03,5.74 38.61,4.32 25.32,4.32 R4.2 20.52,4.35 | U5.7 21.03,36.45 22.23,36.45 22.86,35.81 22.86,32.64 21.97,31.75 18.67,31.75 17.91,30.99 17.91,16.76 | 20.52,4.35 R5.1 | 20.52,4.35 19.14,4.35 17.91,5.59 17.91,16.76 | JPD1.3 17.84,16.84 17.91,16.76
N$34
  Bottom 0.406: D6.A D5.A
N$35
  Top 0.406: R1.2 33.66,51.41 D2.A
  Top 1.27: CON1.2 39.12,64.27 D4.C
  Bottom 1.27: D2.A 38,55.75 39.5,55.75 40.39,56.64 40.39,62.1 39.5,62.99 37.93,62.99 D4.C
N$36
  Bottom 0.406: R2.1 38.05,34.47 38.99,33.53 U6.1
N$37
  Bottom 0.406: R1.1 35.31,35.43 36.45,34.29 U6.2
N$38
  Top 0.406: U5.1 30.53,33.99 31.5,33.02 31.5,29.59 33.02,28.07 59.64,28.07 MC1.5
N$39
  Bottom 0.406: X4.5 114.94,21.46 113.23,23.16 MC3.8
N$40
  Bottom 0.406: MC4.3 107.06,51.44 105.92,52.58 105.92,62.48 106.68,63.25 115.82,63.25 118.87,66.29 X5.1
N$41
  Bottom 0.406: MC5.3 85.72,51.44 85.34,51.82 85.34,62.48 86.11,63.25 92.2,63.25 95.76,66.8 X6.3
N$42
  Bottom 0.406: MC3.9 106.48,25.7 105.92,25.15 105.92,22.1 107.44,20.57 112.01,20.57 113.67,18.92 X4.4
N$43
  Top 0.406: MC5.7 84.58,61.59 83.44,62.74 83.44,68.83 82.3,69.98 75.44,69.98 74.42,70.99 X7.4
N$44
  Top 0.406: MC6.7 64.14,61.59 63.25,62.48 63.25,68.58 62.1,69.72 52.2,69.72 51.44,70.48 X8.6
N$45
  Top 0.406: MC4.7 105.41,61.59 104.01,62.99 104.01,70.61 102.49,72.14 X6.2
N$46
  Top 0.406: LED1.A 32.89,83.31 33.53,83.95 43.81,83.95 44.7,83.06 44.7,46.48 45.47,45.72 R19.1
N$47
  Top 0.406: MC3.6 100.36,25.65 103.12,25.65 104.39,26.92 112.52,26.92 114.3,28.7 114.3,53.09 110.87,56.52 MC4.5
N$48
  Top 0.406: MC5.6 83.44,59.05 82.3,57.78 72.01,57.78 70.61,56.52 MC6.5
N$49
  Top 0.406: MC4.6 104.01,59.05 102.87,57.91 92.08,57.91 90.68,56.52 MC5.5
N$50
  Bottom 0.406: MC4.13 103,48.9 105.16,51.05 105.16,63.25 105.92,64.01 115.06,64.01 117.6,66.55 X5.2
N$51
  Bottom 0.406: MC4.12 103.25,51.44 104.39,52.58 104.39,64.01 105.16,64.77 114.3,64.77 116.33,66.8 X5.3
N$52
  Bottom 0.406: MC4.11 102.74,53.98 103.63,54.86 103.63,64.77 104.39,65.53 113.54,65.53 115.06,67.06 X5.4
N$53
  Bottom 0.406: MC4.10 102.23,56.52 102.87,57.15 102.87,65.53 103.63,66.29 112.78,66.29 113.79,67.31 X5.5
N$54
  Bottom 0.406: MC4.9 101.73,59.05 102.11,59.44 102.11,66.29 102.87,67.06 112.01,67.06 112.52,67.56 X5.6
N$55
  Bottom 0.406: MC4.8 99.19,61.59 98.3,62.48 X6.1
N$56
  Bottom 0.406: MC5.13 83.19,48.9 84.58,50.29 84.58,63.25 85.34,64.01 91.44,64.01 94.49,67.06 X6.4
N$57
  Bottom 0.406: MC5.12 83.44,51.44 83.82,51.82 83.82,64.01 84.58,64.77 90.68,64.77 93.22,67.31 X6.5
N$58
  Bottom 0.406: MC5.11 82.17,53.98 83.06,54.86 83.06,64.77 83.82,65.53 89.92,65.53 91.95,67.56 X6.6
N$59
  Bottom 0.406: MC5.10 81.66,56.52 82.3,57.15 82.3,64.77 81.53,65.53 79.25,65.53 78.23,66.55 X7.1
N$60
  Bottom 0.406: MC5.9 81.15,59.05 81.53,59.44 81.53,64.01 80.77,64.77 78.49,64.77 76.96,66.29 X7.2
N$61
  Bottom 0.406: MC5.8 77.85,61.59 75.69,63.75 X7.3
N$62
  Top 0.406: MC4.2 109.86,48.9 110.74,48.01 110.74,37.85 110.01,37.13 103.58,37.13 102.31,35.87 MC3.2 | OSC.P$5 53.21,32 57.07,35.87 MC1.2
  Bottom 0.406: MC1.2 62.03,35.87 63.25,37.08 69.34,37.08 70.61,35.81 80.06,35.81 MC2.2 81.84,35.87 83.06,37.08 89.74,37.08 90.91,35.92 100.25,35.92 MC3.2 | MC4.2 105.28,48.9 104.14,47.75 94.44,47.75 93.29,48.9 MC5.2 85.42,48.9 84.28,47.75 73.91,47.75 72.77,48.9 MC6.2
N$63
  Bottom 0.406: MC6.13 63.37,48.9 64.77,50.29 64.77,63.25 65.53,64.01 69.34,64.01 71.88,66.55 X7.6
N$64
  Bottom 0.406: MC6.12 62.87,51.44 64.01,52.58 64.01,65.53 63.25,66.29 59.44,66.29 57.78,67.94 X8.1
N$65
  Bottom 0.406: MC6.11 62.36,53.98 63.25,54.86 63.25,64.77 62.48,65.53 58.67,65.53 56.52,67.69 X8.2
N$66
  Bottom 0.406: MC6.10 61.85,56.52 62.48,57.15 62.48,64.01 61.72,64.77 57.91,64.77 55.24,67.44 X8.3
N$67
  Bottom 0.406: MC6.9 60.58,59.05 61.72,60.2 61.72,63.25 60.96,64.01 57.15,64.01 53.98,67.18 X8.4
N$68
  Bottom 0.406: X8.5 52.7,66.55 57.66,61.59 MC6.8
N$70
  Bottom 1.27: 53.12,52.01 C1.1 53.09,52.02 53.09,54.36 51.76,55.68 D2.C 43,55.68 42.93,55.75 | 42.93,55.75 42.93,53.72 44.83,51.82 48.08,51.82 D1.C | REG.1 40.77,74.68 42.8,72.64 42.8,55.88 42.93,55.75
N$80
  Top 0.406: MC1.4 62.79,30.79 64.01,32 76.45,32 77.72,30.73 80.06,30.73 MC2.4 83.11,30.79 84.33,32 97.28,32 98.55,30.73 100.25,30.73 MC3.4 100.36,30.73 103.12,30.73 104.39,32 111.25,32 112.52,33.27 112.52,52.58 111.12,53.98 MC4.4 104.01,53.98 102.87,52.83 92.33,52.83 91.19,53.98 MC5.4 83.44,53.98 82.3,52.83 72.77,52.83 71.63,53.98 MC6.4
  Bottom 0.406: MC1.4 59.79,30.76 56.67,30.76 54.1,28.19 41.15,28.19 | R14.1 42.8,39.75 41.15,38.1 41.15,28.19 | U6.5 36.45,24.66 37.19,25.4 40.39,25.4 41.15,26.16 41.15,28.19
N$81
  Top 0.406: MC2.5 69.9,28.25 68.58,26.92 64.01,26.92 62.74,25.65 59.87,25.65 MC1.6
N$82
  Top 0.406: MC3.5 90.47,28.25 89.15,26.92 84.33,26.92 83.06,25.65 80.16,25.65 MC2.6
VCC
  Bottom 0.406: 20.74,45.87 U4.8 20.71,45.85 19.18,45.85 18.29,44.96 18.29,34.67 18.97,33.99 U5.8